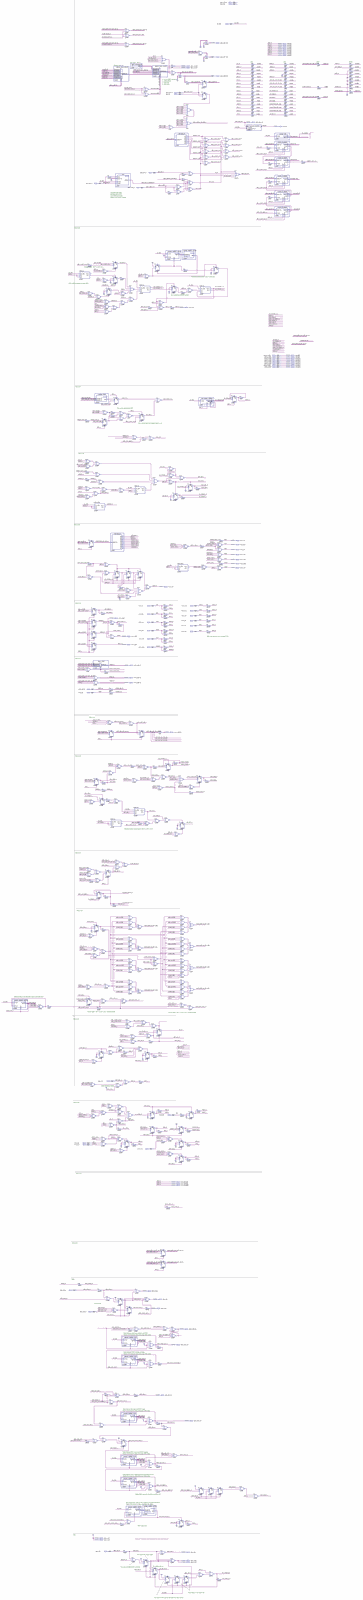
[diagram p0: schematic sheet, whole]
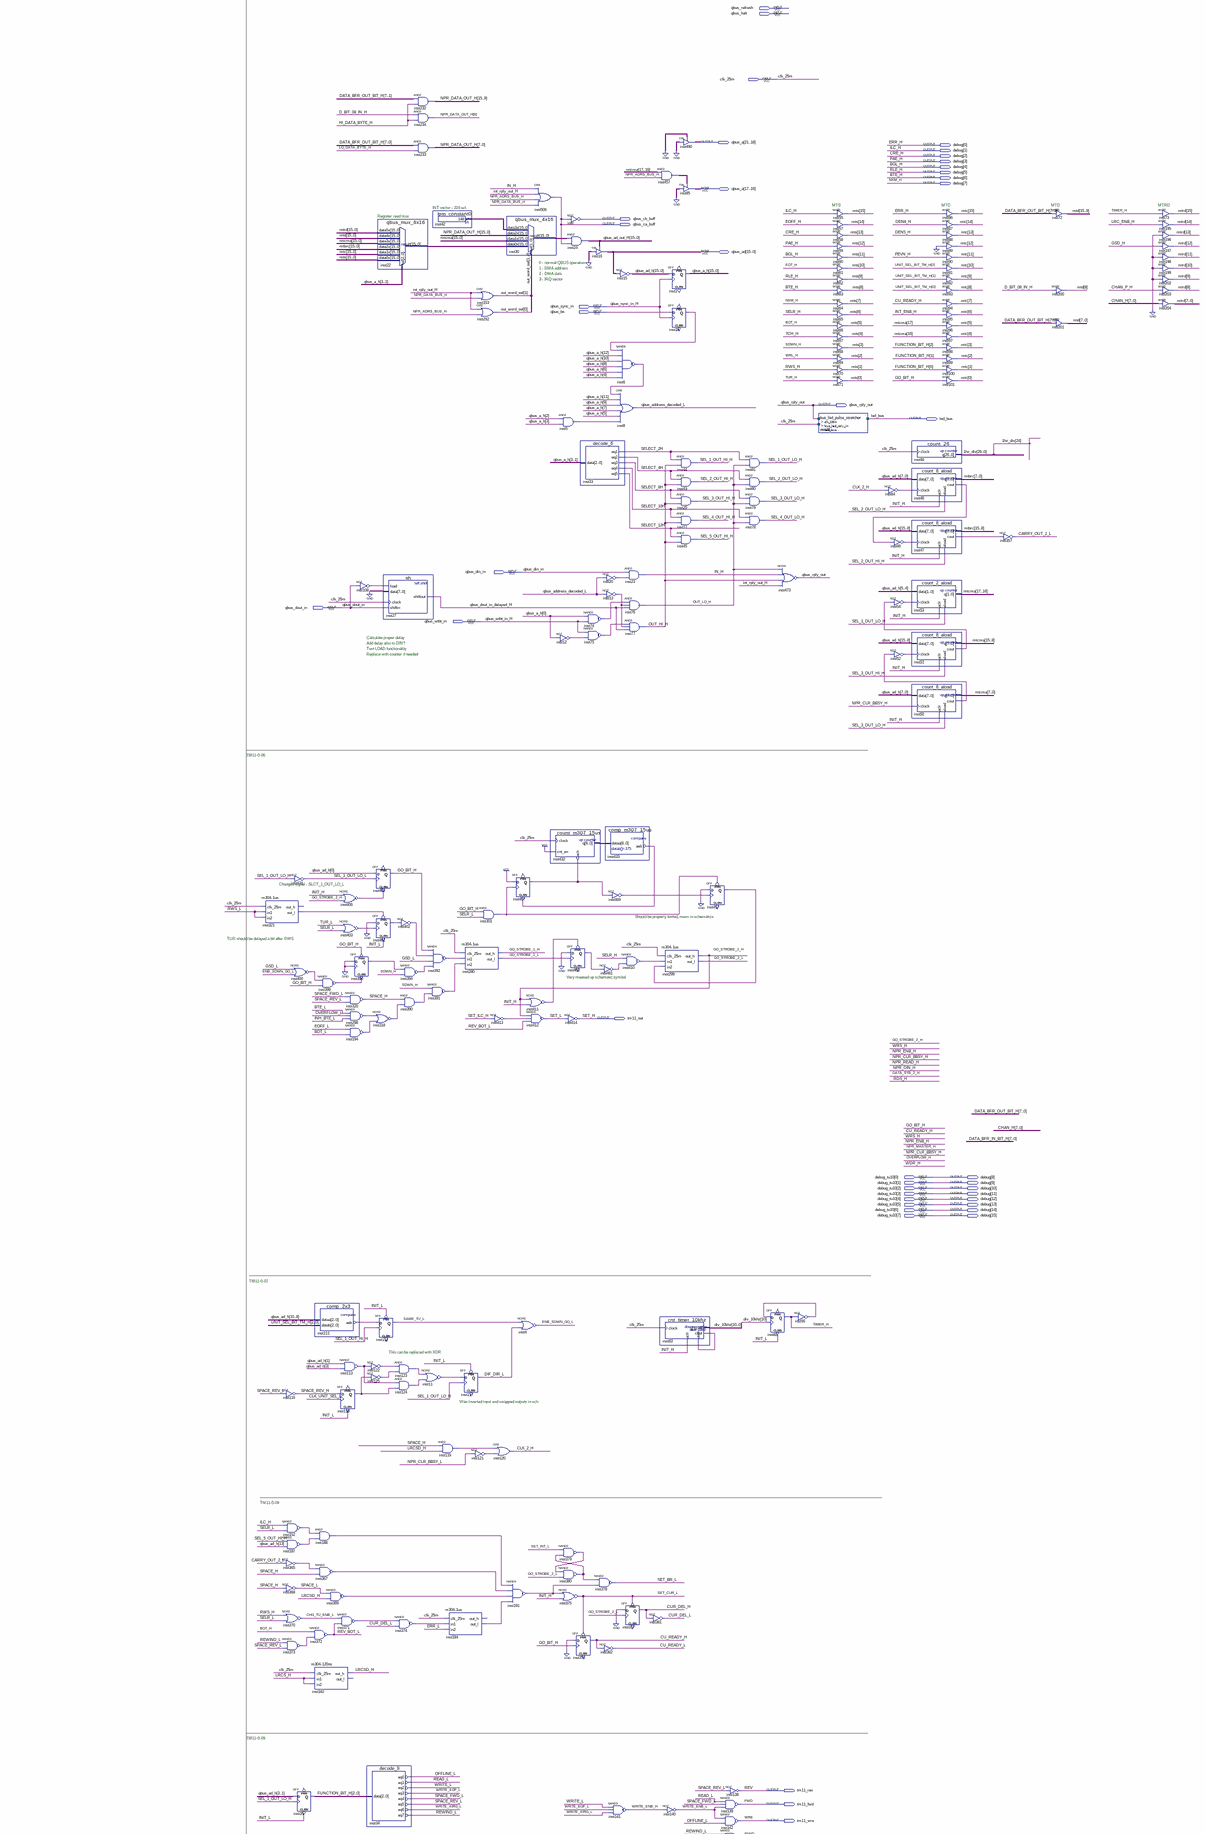
[diagram p1: schematic sheet, upper part]
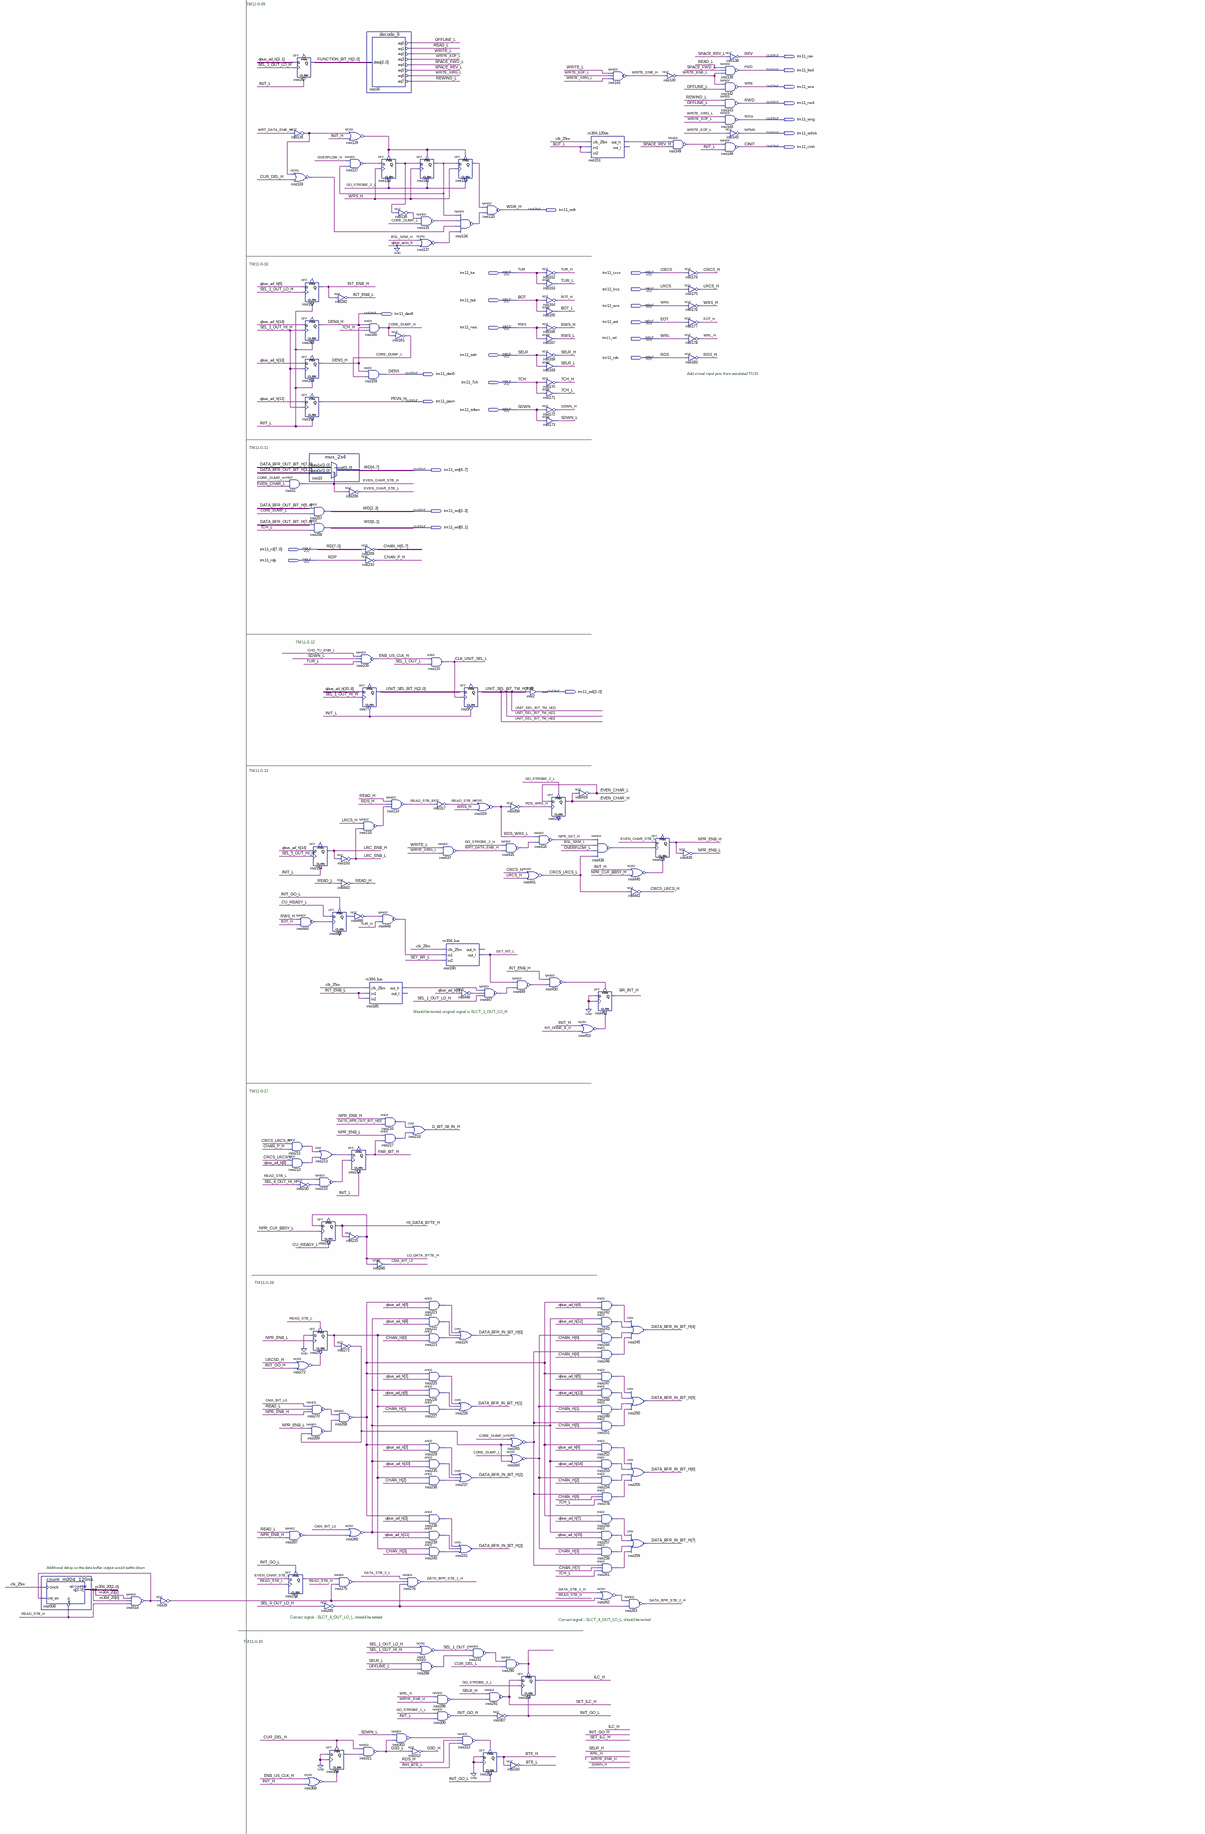
[diagram p2: schematic sheet, middle part]
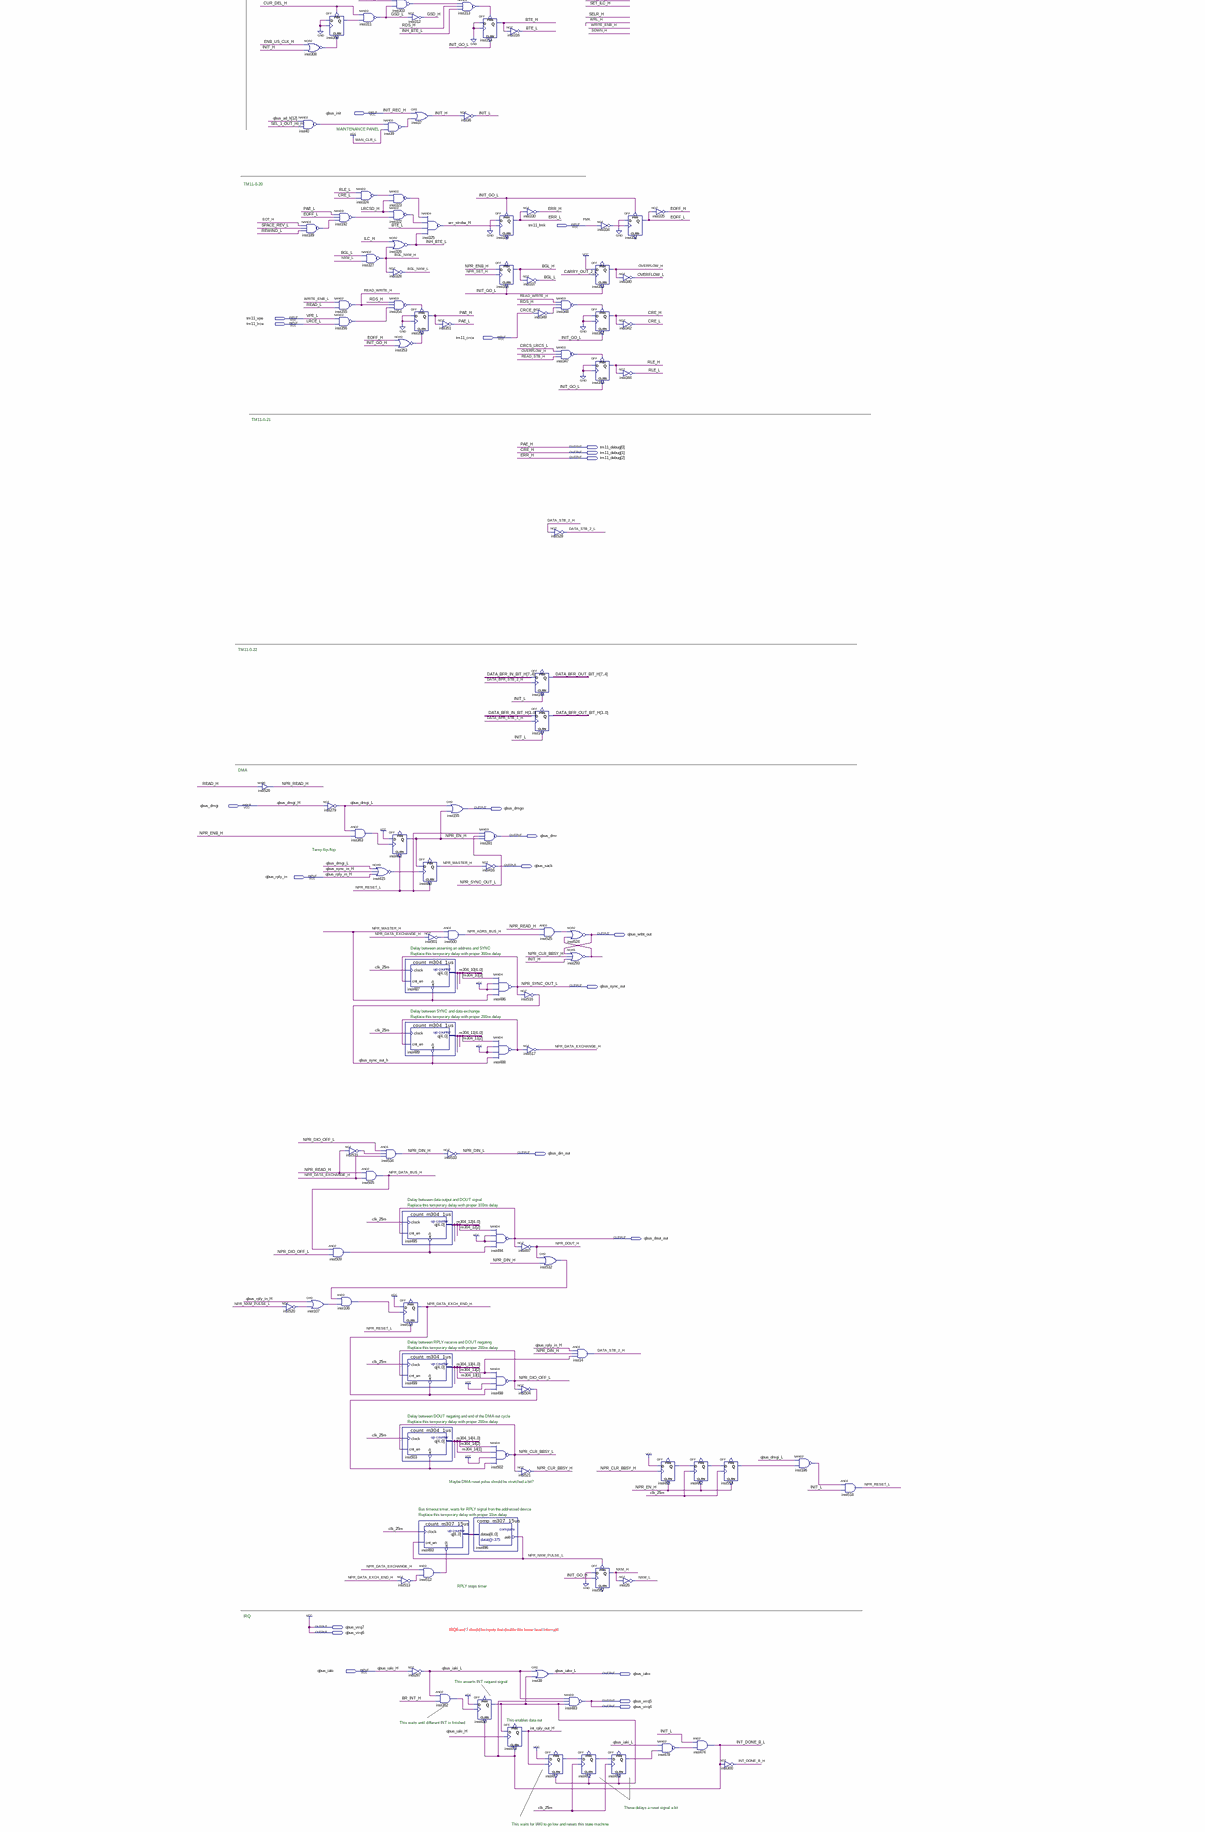
[diagram p3: schematic sheet, lower part]
// Quartus schematic tm11.bdf as structural Verilog: 451 symbols, 92 pins
module tm11 (
  input  qbus_refresh,
  input  qbus_halt,
  input  clk_25m,
  input  qbus_sync_in,
  input  qbus_bs,
  input  qbus_din_in,
  input  qbus_dout_in,
  input  qbus_wtbt_in,
  input  [7:0] debug_tu10,
  input  tm11_tur,
  input  tm11_crcs,
  input  tm11_lrcs,
  input  tm11_bot,
  input  tm11_wrs,
  input  tm11_eot,
  input  tm11_rws,
  input  tm11_wrl,
  input  tm11_selr,
  input  tm11_rds,
  input  tm11_7ch,
  input  tm11_sdwn,
  input  [7:0] tm11_rd,
  input  tm11_rdp,
  input  qbus_init,
  input  tm11_fmk,
  input  tm11_vpe,
  input  tm11_lrce,
  input  tm11_crce,
  input  qbus_dmgi,
  input  qbus_rply_in,
  input  qbus_iaki,
  inout  [21:16] qbus_a,
  inout  [15:0] qbus_ad,
  output [15:0] debug,
  output qbus_cb_buff,
  output qbus_ca_buff,
  output qbus_rply_out,
  output led_bus,
  output tm11_set,
  output tm11_rev,
  output tm11_fwd,
  output tm11_wre,
  output tm11_rwd,
  output tm11_wxg,
  output tm11_wfmk,
  output tm11_cinit,
  output tm11_wdr,
  output tm11_den8,
  output tm11_den5,
  output tm11_pevn,
  output [0:7] tm11_wd,
  output [2:0] tm11_sel,
  output [2:0] tm11_debug,
  output qbus_dmgo,
  output qbus_dmr,
  output qbus_sack,
  output qbus_wtbt_out,
  output qbus_sync_out,
  output qbus_din_out,
  output qbus_dout_out,
  output qbus_virq7,
  output qbus_virq6,
  output qbus_iako,
  output qbus_virq5,
  output qbus_virq4
);

  wire \7CH_H , \7CH_L , BGL_L, BGL_NXM_H, BGL_NXM_L, BOT_H, BOT_L, BR_INT_H, BTE_L, CARRY_OUT_2_L, CHAN_P_H,
       CHG_TU_ENB_L, CLK_2_H, CLK_UNIT_SEL_L, CMA_BIT_L0, CORE_DUMP_H, CORE_DUMP_L, CRCS_H, CRCS_LRCS_H,
       CRCS_LRCS_L, CRE_L, CU_READY_H, CU_READY_L, CUR_DEL_H, CUR_DEL_L, D_BIT_08_IN_H, DATA_BFR_STB_1_H,
       DATA_BFR_STB_2_H, DATA_STB_2_H, DATA_STB_2_L, DEN5_H, DIF_DIR_L, ENB_SDWN_GO_L, ENB_US_CLK_H, EOFF_H,
       EOFF_L, EOT_H, ERR_L, err_strobe_H, EVEN_CHAR_H, EVEN_CHAR_L, EVEN_CHAR_STB_H, EVEN_CHAR_STB_L,
       GO_BIT_H, GO_STROBE_1_H, GO_STROBE_1_L, GO_STROBE_2_H, GO_STROBE_2_L, GSD_H, GSD_L, HI_DATA_BYTE_H,
       IN_H, INH_BTE_L, INIT_GO_H, INIT_GO_L, INIT_H, INIT_L, inst5_out, inst6_out, inst11_out, inst12_out,
       inst13_out, inst18_q, inst20_out, inst29_out, inst34_eq0, inst34_eq1, inst34_eq2, inst34_eq3,
       inst34_eq4, inst34_eq5, inst34_eq6, inst34_eq7, inst39_out, inst40_out, inst46_cout, inst47_cout,
       inst49_out, inst50_cout, inst51_cout, inst52_out, inst54_out, inst56_out, inst74_out, inst75_out,
       inst83_cout, inst84_out, inst106_out, inst107_out, inst108_out, inst111_aeb, inst111_aeb_inverted_out,
       inst113_out, inst115_q, inst118_out, inst119_out, inst121_out, inst122_out, inst123_out, inst124_out,
       inst125_out, inst126_out, inst127_out, inst128_out, inst129_out, inst130_q, inst131_q, inst132_q,
       inst134_out, inst135_out, inst136_out, inst137_out, inst149_out, inst151_out_h, inst152_out,
       inst184_out_l, inst185_out_h, inst186_out, inst187_out, inst188_out, inst189_out, inst191_out,
       inst192_out, inst194_out, inst211_out, inst212_out, inst213_out, inst215_out, inst216_out,
       inst217_out, inst221_out, inst222_out, inst223_out, inst225_out, inst226_out, inst227_out,
       inst229_out, inst230_out, inst231_out, inst235_out, inst236_out, inst238_out, inst239_out,
       inst240_out, inst242_out, inst243_out, inst244_out, inst246_out, inst247_out, inst248_out,
       inst249_out, inst251_out, inst252_out, inst253_out, inst254_out, inst256_out, inst257_out,
       inst258_out, inst261_out, inst262_out, inst264_out, inst265_out, inst266_out, inst267_out,
       inst268_out, inst269_out, inst270_out, inst271_out, inst272_out, inst274_q, inst275_out, inst277_q,
       inst278_out, inst285_out, inst288_out, inst290_out, inst293_out, inst296_out, inst298_out,
       inst301_out, inst303_out, inst308_out, inst309_q, inst313_out, inst318_out, inst321_out_l,
       inst322_out, inst323_out, inst324_out, inst334_out, inst347_out, inst348_out, inst349_out,
       inst353_out, inst354_out, inst356_out, inst362_out, inst363_out, inst365_out, inst367_out,
       inst369_out, inst371_out, inst373_out, inst374_out, inst379_out, inst380_out, inst390_out,
       inst391_out, inst392_out, inst394_out, inst396_q, inst399_out, inst400_out, inst401_q, inst402_out,
       inst403_out, inst406_out, inst408_q, inst410_out, inst411_out, inst413_out, inst415_out, inst417_q,
       inst430_q, inst433_aeb, inst433_aeb_inverted_out, inst435_out, inst436_out, inst440_out, inst444_out,
       inst445_q, inst446_out, inst447_out, inst448_out, inst449_out, inst450_out, inst453_out, inst466_out,
       inst467_q, inst469_out, inst471_q, inst477_q, inst478_out, inst479_q, inst481_out, inst482_q,
       inst485_q, inst488_out, inst496_aeb, inst501_out, inst504_out, inst509_out, inst512_out, inst513_out,
       inst514_out, inst519_q, inst520_out, inst525_out, inst531_out, inst532_out, INT_DONE_B_H,
       INT_DONE_B_L, INT_ENB_H, INT_ENB_L, int_rply_out_H, LO_DATA_BYTE_H, LRC_ENB_H, LRC_ENB_L, LRCS_H,
       LRCSD_H, NPR_ADRS_BUS_H, NPR_CLR_BBSY_H, NPR_CLR_BBSY_L, NPR_DATA_BUS_H, NPR_DATA_EXCH_END_H,
       NPR_DATA_EXCHANGE_H, NPR_DIN_H, NPR_DIO_OFF_L, NPR_DOUT_H, NPR_EN_H, NPR_ENB_H, NPR_ENB_L,
       NPR_MASTER_H, NPR_NXM_PULSE_L, NPR_READ_H, NPR_RESET_L, NPR_SET_H, NXM_L, OFFLINE_L, OUT_HI_H,
       OUT_LO_H, OVERFLOW_H, OVERFLOW_L, PAE_L, PAR_BIT_H, qbus_address_decoded_L, qbus_dmgi_L,
       qbus_dout_in_delayed_H, qbus_iaki_L, qbus_sync_out_h, RDS_H, RDS_WRS_H, RDS_WRS_L, READ_H, READ_L,
       READ_STB_H, READ_STB_L, READ_WRITE_H, REV_BOT_L, REWIND_L, RLE_L, RWS_H, RWS_L, SAME_TU_L, SDWN_H,
       SDWN_L, SEL_1_OUT_HI_H, SEL_1_OUT_L, SEL_1_OUT_LO_H, SEL_1_OUT_LO_L, SEL_2_OUT_HI_H, SEL_2_OUT_LO_H,
       SEL_3_OUT_HI_H, SEL_3_OUT_LO_H, SEL_4_OUT_HI_H, SEL_4_OUT_LO_H, SEL_5_OUT_HI_H, SELECT_2H, SELECT_4H,
       SELECT_6H, SELECT_10H, SELECT_12H, SELR_H, SELR_L, SET_BR_L, SET_CUR_L, SET_ILC_H, SET_INT_L, SET_L,
       SPACE_FWD_L, SPACE_H, SPACE_L, SPACE_REV_H, SPACE_REV_L, TIMER_H, TUR_H, TUR_L, WRITE_ENB_H,
       WRITE_ENB_L, WRITE_EOF_L, WRITE_L, WRITE_XIRG_L, WRL_H, WRS_H, WRT_DATA_ENB_H;
  wire [1:0] inst457_out, out_word_sel;
  wire [2:0] FUNCTION_BIT_H, m304_20, UNIT_SEL_BIT_H, UNIT_SEL_BIT_TM_H;
  wire [4:0] m304_10, m304_11, m304_12, m304_13, m304_14;
  wire [7:0] CHAN_H, DATA_BFR_IN_BIT_H, DATA_BFR_OUT_BIT_H;
  wire [8:0] inst432_q, inst493_q;
  wire [10:0] div_10khz;
  wire [15:0] inst22_result, inst30_result, inst42_result, mtbrc, mtc, mtd, mtrd, mts, NPR_DATA_OUT_H,
       qbus_a_h, qbus_ad_h, qbus_ad_out_H;
  wire [17:0] mtcma;
  wire [26:0] \1hz_div ;

  count_m304_120ns inst508 (.aclr(~READ_STB_H), .clock(clk_25m), .cnt_en(inst514_out), .q(m304_20));
  nand inst514 (inst514_out, m304_20[2], m304_20[0], READ_STB_H);
  not inst29 (inst29_out, inst514_out);
  assign NPR_READ_H = READ_H;  // WIRE inst526
  \m304-1us  inst321 (.clk_25m(clk_25m), .in1(RWS_L), .in2(RWS_L), .out_l(inst321_out_l));  // open: out_h
  not inst431 (SEL_1_OUT_LO_L, SEL_1_OUT_LO_H);
  nor inst400 (inst400_out, GSD_L, ENB_SDWN_GO_L);
  not inst116 (SPACE_REV_H, SPACE_REV_L);
  nand inst152 (inst152_out, debug[1], SELR_L);
  nand inst187 (inst187_out, SEL_5_OUT_HI_H, qbus_ad_h[13]);
  not inst365 (inst365_out, CARRY_OUT_2_L);
  not inst368 (SPACE_L, SPACE_H);
  nor inst370 (CHG_TU_ENB_L, RWS_H, SELR_L);
  nand inst373 (inst373_out, REWIND_L, SPACE_REV_L);
  DFF inst35[2:0] (.CLRN(INIT_L), .CLK(SEL_1_OUT_LO_H), .D(qbus_ad_h[3:1]), .Q(FUNCTION_BIT_H));  // open: PRN
  not inst126 (inst126_out, WRT_DATA_ENB_H);
  nor inst128 (inst128_out, inst126_out, CUR_DEL_H);
  DFF inst157 (.CLRN(INIT_L), .CLK(SEL_1_OUT_LO_H), .D(qbus_ad_h[6]), .Q(INT_ENB_H));  // open: PRN
  DFF inst283 (.CLRN(INIT_L), .CLK(SEL_1_OUT_HI_H), .D(qbus_ad_h[14]), .Q(tm11_den8));  // open: PRN
  DFF inst156 (.CLRN(INIT_L), .CLK(SEL_1_OUT_HI_H), .D(qbus_ad_h[13]), .Q(DEN5_H));  // open: PRN
  DFF inst158 (.CLRN(INIT_L), .CLK(SEL_1_OUT_HI_H), .D(qbus_ad_h[11]), .Q(tm11_pevn));  // open: PRN
  and inst31 (EVEN_CHAR_STB_H, CORE_DUMP_H, EVEN_CHAR_L);
  nand inst444 (inst444_out, RWS_H, BOT_H);
  and inst211 (inst211_out, CRCS_LRCS_H, CHAN_P_H);
  and inst212 (inst212_out, CRCS_LRCS_L, qbus_ad_h[8]);
  not inst230 (inst230_out, SEL_4_OUT_HI_H);
  nor inst272 (inst272_out, LRCSD_H, INIT_GO_H);
  nand inst267 (inst267_out, READ_L, NPR_ENB_H);
  DFF inst274 (.CLK(READ_STB_L), .D(EVEN_CHAR_STB_L), .PRN(INIT_GO_L), .Q(inst274_q));  // open: CLRN
  nand inst40 (inst40_out, qbus_ad_h[12], SEL_1_OUT_HI_H);
  nand inst189 (inst189_out, EOT_H, SPACE_REV_L, REWIND_L);
  not inst520 (inst520_out, NPR_NXM_PULSE_L);
  nand inst399 (inst399_out, inst400_out, GO_BIT_H);
  comp_2x3 inst111 (.dataa(qbus_ad_h[10:8]), .datab(UNIT_SEL_BIT_TM_H), .aeb(inst111_aeb));
  not inst111_aeb_inverted (inst111_aeb_inverted_out, inst111_aeb);
  and inst188 (inst188_out, inst152_out, inst187_out);
  nand inst367 (inst367_out, inst365_out, SPACE_H);
  nand inst372 (REV_BOT_L, BOT_H, inst373_out);
  \m304-120ns  inst182 (.clk_25m(clk_25m), .in1(LRCS_H), .in2(LRCS_H), .out_h(LRCSD_H));  // open: out_l
  mux_2x4 inst10 (
    .data1x(DATA_BFR_OUT_BIT_H[7:4]), .data0x(DATA_BFR_OUT_BIT_H[3:0]), .sel(EVEN_CHAR_STB_H),
    .result(tm11_wd[4:7]));
  assign tm11_wd[2:3] = DATA_BFR_OUT_BIT_H[5:4] & {2{CORE_DUMP_L}};  // AND2 inst207, 2 bits wide
  assign tm11_wd[0:1] = DATA_BFR_OUT_BIT_H[7:6] & {2{\7CH_L }};  // AND2 inst208, 2 bits wide
  DFF inst154 (.CLRN(INIT_L), .CLK(SEL_5_OUT_HI_H), .D(qbus_ad_h[14]), .Q(LRC_ENB_H));  // open: PRN
  or inst213 (inst213_out, inst211_out, inst212_out);
  nand inst215 (inst215_out, READ_STB_L, inst230_out);
  DFF inst219 (.CLRN(CU_READY_L), .CLK(NPR_CLR_BBSY_L), .D(LO_DATA_BYTE_H), .Q(HI_DATA_BYTE_H));  // open: PRN
  DFF inst277 (.CLRN(inst272_out), .CLK(NPR_ENB_L), .D(1'b0), .PRN(READ_STB_L), .Q(inst277_q));
  nand inst270 (inst270_out, CMA_BIT_L0, READ_L, NPR_ENB_H);
  nand inst269 (inst269_out, NPR_ENB_L, inst271_out);
  not inst285 (inst285_out, SEL_4_OUT_LO_H);
  nor inst308 (inst308_out, ENB_US_CLK_H, INIT_H);
  not inst279 (qbus_dmgi_L, qbus_dmgi);
  or inst107 (inst107_out, qbus_rply_in, inst520_out);
  nor inst406 (inst406_out, INIT_H, GO_STROBE_2_H);
  nor inst403 (inst403_out, TUR_L, SELR_L);
  nand inst320 (SPACE_H, SPACE_FWD_L, SPACE_REV_L);
  nand inst298 (inst298_out, BTE_L, OVERFLOW_L, INH_BTE_L);
  nand inst194 (inst194_out, EOFF_L, BOT_L);
  nand inst113 (inst113_out, qbus_ad_h[1], qbus_ad_h[3]);
  DFF inst115 (.CLRN(INIT_L), .CLK(CLK_UNIT_SEL_L), .D(SPACE_REV_H), .Q(inst115_q));  // open: PRN
  nand inst369 (inst369_out, SPACE_L, LRCSD_H);
  nand inst371 (inst371_out, CHG_TU_ENB_L, REV_BOT_L);
  nor inst129 (inst129_out, inst126_out, INIT_H);
  nand inst127 (inst127_out, OVERFLOW_H, inst131_q);
  not inst282 (INT_ENB_L, INT_ENB_H);
  not inst206 (EVEN_CHAR_STB_L, EVEN_CHAR_STB_H);
  not inst193 (LRC_ENB_L, LRC_ENB_H);
  not inst443 (READ_H, READ_L);
  DFF inst445 (.CLK(inst444_out), .D(CU_READY_L), .PRN(INIT_GO_L), .Q(inst445_q));  // open: CLRN
  not inst220 (LO_DATA_BYTE_H, HI_DATA_BYTE_H);
  not inst271 (inst271_out, inst277_q);
  nand inst268 (inst268_out, inst270_out, inst269_out);
  nor inst266 (inst266_out, CMA_BIT_L0, inst267_out);
  nand inst275 (inst275_out, inst274_q, inst29_out);
  DFF inst309 (.CLRN(inst308_out), .CLK(1'b0), .D(1'b0), .PRN(CUR_DEL_H), .Q(inst309_q));
  nand inst192 (inst192_out, PAE_L, EOFF_L, inst189_out);
  nand inst355 (READ_WRITE_H, WRITE_ENB_L, READ_L);
  nand inst356 (inst356_out, tm11_vpe, tm11_lrce);
  not inst531 (inst531_out, NPR_READ_H);
  and inst509 (inst509_out, NPR_DATA_BUS_H, NPR_DIO_OFF_L);
  and inst106 (inst106_out, inst532_out, inst107_out);
  not inst108 (inst108_out, qbus_dout_in);
  DFF inst396 (.CLRN(inst399_out), .CLK(1'b0), .D(1'b0), .PRN(GO_BIT_H), .Q(inst396_q));
  not inst122 (inst122_out, inst113_out);
  not inst125 (inst125_out, inst115_q);
  decode_8 inst34 (
    .data(FUNCTION_BIT_H), .eq0(inst34_eq0), .eq1(inst34_eq1), .eq2(inst34_eq2), .eq3(inst34_eq3),
    .eq4(inst34_eq4), .eq5(inst34_eq5), .eq6(inst34_eq6), .eq7(inst34_eq7));
  not inst34_eq0_inverted (OFFLINE_L, inst34_eq0);
  not inst34_eq1_inverted (READ_L, inst34_eq1);
  not inst34_eq2_inverted (WRITE_L, inst34_eq2);
  not inst34_eq3_inverted (WRITE_EOF_L, inst34_eq3);
  not inst34_eq4_inverted (SPACE_FWD_L, inst34_eq4);
  not inst34_eq5_inverted (SPACE_REV_L, inst34_eq5);
  not inst34_eq6_inverted (WRITE_XIRG_L, inst34_eq6);
  not inst34_eq7_inverted (REWIND_L, inst34_eq7);
  and inst160 (CORE_DUMP_H, tm11_den8, DEN5_H, \7CH_H );
  and inst159 (tm11_den5, DEN5_H, CORE_DUMP_L);
  assign {CHAN_H[0], CHAN_H[1], CHAN_H[2], CHAN_H[3], CHAN_H[4], CHAN_H[5], CHAN_H[6], CHAN_H[7]} = ~tm11_rd;  // NOT inst209, 8 bits wide
  not inst210 (CHAN_P_H, tm11_rdp);
  nand inst109 (ENB_US_CLK_H, CHG_TU_ENB_L, SDWN_L, TUR_L);
  DFF inst7[2:0] (.CLRN(INIT_L), .CLK(SEL_1_OUT_HI_H), .D(qbus_ad_h[10:8]), .Q(UNIT_SEL_BIT_H));  // open: PRN
  nand inst118 (inst118_out, LRCS_H, LRC_ENB_L);
  not inst466 (inst466_out, inst445_q);
  \m304-1us  inst185 (.clk_25m(clk_25m), .in1(INT_ENB_L), .in2(INT_ENB_L), .out_h(inst185_out_h));  // open: out_l
  DFF inst214 (.CLRN(INIT_L), .CLK(inst215_out), .D(inst213_out), .Q(PAR_BIT_H));  // open: PRN
  nand inst311 (GSD_L, CUR_DEL_H, inst309_q);
  nand inst324 (inst324_out, RLE_L, CRE_L);
  nand inst327 (BGL_NXM_H, BGL_L, NXM_L);
  and inst363 (inst363_out, qbus_dmgi_L, NPR_ENB_H);
  and inst505 (NPR_DATA_BUS_H, NPR_READ_H, NPR_DATA_EXCHANGE_H);
  qbus_mux_8x16 inst22 (
    .data5x(mtrd), .data4x(mtd), .data3x(mtcma[15:0]), .data2x(mtbrc), .data1x(mtc), .data0x(mts),
    .sel(qbus_a_h[3:1]), .result(inst22_result));
  sh inst27 (
    .load(inst108_out), .data({8{1'b0}}), .clock(clk_25m), .shiftin(qbus_dout_in),
    .shiftout(qbus_dout_in_delayed_H));
  DFF inst405 (.CLRN(inst406_out), .CLK(SEL_1_OUT_LO_L), .D(qbus_ad_h[0]), .Q(GO_BIT_H));  // open: PRN
  DFF inst401 (.CLRN(INIT_L), .CLK(inst403_out), .D(1'b0), .PRN(inst321_out_l), .Q(inst401_q));
  nor inst318 (inst318_out, inst298_out, inst194_out);
  DFF inst112 (.CLK(SEL_1_OUT_HI_H), .D(inst111_aeb_inverted_out), .PRN(INIT_L), .Q(SAME_TU_L));  // open: CLRN
  DFF inst130 (.CLRN(GO_STROBE_2_L), .CLK(WRS_H), .D(inst127_out), .PRN(inst129_out), .Q(inst130_q));
  nand inst114 (READ_STB_L, READ_H, RDS_H, inst118_out);
  nand inst446 (inst446_out, inst466_out, TUR_H);
  and inst216 (inst216_out, NPR_ENB_H, DATA_BFR_OUT_BIT_H[0]);
  and inst217 (inst217_out, NPR_ENB_L, PAR_BIT_H);
  assign CMA_BIT_L0 = LO_DATA_BYTE_H;  // WIRE inst286
  nand inst39 (inst39_out, inst40_out, 1'b1);
  nand inst323 (inst323_out, inst324_out, LRCSD_H);
  nand inst322 (inst322_out, LRCSD_H, inst192_out);
  nor inst326 (INH_BTE_L, debug[1], BGL_NXM_H);
  not inst328 (BGL_NXM_L, BGL_NXM_H);
  nand inst354 (inst354_out, RDS_H, READ_WRITE_H, inst356_out);
  DFF inst468 (.CLRN(NPR_RESET_L), .CLK(inst363_out), .D(1'b1), .Q(NPR_EN_H));  // open: PRN
  nor inst415 (inst415_out, qbus_dmgi_L, qbus_sync_in, qbus_rply_in);
  and inst534 (NPR_DIN_H, NPR_DIO_OFF_L, inst531_out, NPR_DATA_EXCHANGE_H);
  not inst402 (inst402_out, inst401_q);
  nand inst394 (inst394_out, inst396_q, SDWN_H);
  and inst390 (inst390_out, SPACE_H, inst318_out);
  and inst123 (inst123_out, inst122_out, inst125_out);
  and inst124 (inst124_out, inst113_out, inst115_q);
  nand inst374 (inst374_out, inst371_out, CUR_DEL_L);
  not inst136 (inst136_out, inst130_q);
  not inst161 (CORE_DUMP_L, CORE_DUMP_H);
  or inst218 (D_BIT_08_IN_H, inst216_out, inst217_out);
  nand inst276 (DATA_BFR_STB_1_H, DATA_STB_2_L, inst275_out, inst285_out);
  nand inst303 (inst303_out, SDWN_L, GSD_L);
  not inst312 (GSD_H, GSD_L);
  or inst37 (INIT_H, qbus_init, inst39_out);
  DFF inst350 (.CLRN(inst353_out), .CLK(1'b0), .D(1'b0), .PRN(inst354_out), .Q(debug[3]));
  nor inst353 (inst353_out, EOFF_H, INIT_GO_H);
  count_m304_1us inst487 (.aclr(~NPR_MASTER_H), .clock(clk_25m), .cnt_en(qbus_sync_out), .q(m304_10));
  count_m304_1us inst489 (.aclr(~qbus_sync_out_h), .clock(clk_25m), .cnt_en(inst488_out), .q(m304_11));
  count_m304_1us inst495 (.aclr(~inst509_out), .clock(clk_25m), .cnt_en(qbus_dout_out), .q(m304_12));
  DFF inst510 (.CLRN(NPR_RESET_L), .CLK(inst106_out), .D(1'b1), .Q(NPR_DATA_EXCH_END_H));  // open: PRN
  count_m304_1us inst499 (.aclr(~NPR_DATA_EXCH_END_H), .clock(clk_25m), .cnt_en(NPR_DIO_OFF_L), .q(m304_13));
  count_m304_1us inst503 (.aclr(~inst504_out), .clock(clk_25m), .cnt_en(NPR_CLR_BBSY_L), .q(m304_14));
  not inst513 (inst513_out, NPR_DATA_EXCH_END_H);
  not inst287 (qbus_iaki_L, qbus_iaki);
  assign NPR_DATA_OUT_H[15:9] = DATA_BFR_OUT_BIT_H[7:1] & {7{HI_DATA_BYTE_H}};  // AND2 inst232, 7 bits wide
  and inst234 (NPR_DATA_OUT_H[8], D_BIT_08_IN_H, HI_DATA_BYTE_H);
  assign NPR_DATA_OUT_H[7:0] = DATA_BFR_OUT_BIT_H & {8{LO_DATA_BYTE_H}};  // AND2 inst233, 8 bits wide
  lpm_constant0 inst42 (.result(inst42_result));
  nand inst392 (inst392_out, GO_BIT_H, inst402_out, GSD_L, inst394_out);
  nand inst391 (inst391_out, SDWN_H, inst390_out);
  nor inst11 (inst11_out, inst123_out, inst124_out);
  DFF inst131 (.CLRN(GO_STROBE_2_L), .CLK(WRS_H), .D(inst130_q), .PRN(inst129_out), .Q(inst131_q));
  nand inst135 (inst135_out, inst136_out, CORE_DUMP_L);
  nor inst137 (inst137_out, BGL_NXM_H, 1'b0);
  and inst110 (CLK_UNIT_SEL_L, ENB_US_CLK_H, SEL_1_OUT_L);
  not inst317 (READ_STB_H, READ_STB_L);
  and inst221 (inst221_out, inst268_out, qbus_ad_h[0]);
  and inst222 (inst222_out, inst266_out, qbus_ad_h[8]);
  and inst223 (inst223_out, inst277_q, CHAN_H[0]);
  and inst225 (inst225_out, inst268_out, qbus_ad_h[1]);
  and inst226 (inst226_out, inst266_out, qbus_ad_h[9]);
  and inst227 (inst227_out, inst277_q, CHAN_H[1]);
  and inst229 (inst229_out, inst268_out, qbus_ad_h[2]);
  and inst235 (inst235_out, inst266_out, qbus_ad_h[10]);
  and inst236 (inst236_out, inst277_q, CHAN_H[2]);
  and inst238 (inst238_out, inst268_out, qbus_ad_h[3]);
  and inst239 (inst239_out, inst266_out, qbus_ad_h[11]);
  and inst240 (inst240_out, inst277_q, CHAN_H[3]);
  nor inst3 (SEL_1_OUT_L, SEL_1_OUT_LO_H, SEL_1_OUT_HI_H);
  nand inst288 (inst288_out, SELR_L, OFFLINE_L);
  nand inst296 (inst296_out, WRL_H, WRITE_ENB_H);
  nand inst306 (INIT_GO_H, GO_STROBE_1_L, INIT_L);
  nand inst325 (err_strobe_H, inst323_out, inst322_out, BTE_L, INH_BTE_L);
  DFF inst480 (.CLRN(NPR_RESET_L), .CLK(inst415_out), .D(NPR_EN_H), .Q(NPR_MASTER_H));  // open: PRN
  not inst501 (inst501_out, NPR_DATA_EXCHANGE_H);
  count_m307_15us inst493 (.aclr(~inst512_out), .clock(clk_25m), .cnt_en(NPR_NXM_PULSE_L), .q(inst493_q));
  and inst512 (inst512_out, NPR_DATA_EXCHANGE_H, inst513_out);
  and inst119 (inst119_out, SPACE_H, LRCSD_H);
  \m304-1us  inst184 (.clk_25m(clk_25m), .in1(inst374_out), .in2(ERR_L), .out_l(inst184_out_l));  // open: out_h
  DFF inst132 (.CLRN(GO_STROBE_2_L), .CLK(WRS_H), .D(inst131_q), .PRN(inst129_out), .Q(inst132_q));
  nand inst134 (inst134_out, inst131_q, inst135_out, inst128_out, inst137_out);
  nand inst437 (WRT_DATA_ENB_H, WRITE_L, WRITE_XIRG_L);
  \m304-1us  inst190 (.clk_25m(clk_25m), .in1(inst446_out), .in2(SET_BR_L), .out_l(SET_INT_L));  // open: out_h
  or inst224 (DATA_BFR_IN_BIT_H[0], inst221_out, inst222_out, inst223_out);
  or inst228 (DATA_BFR_IN_BIT_H[1], inst225_out, inst226_out, inst227_out);
  or inst237 (DATA_BFR_IN_BIT_H[2], inst229_out, inst235_out, inst236_out);
  or inst241 (DATA_BFR_IN_BIT_H[3], inst238_out, inst239_out, inst240_out);
  not inst351 (PAE_L, debug[3]);
  or inst155 (qbus_dmgo, qbus_dmgi_L, NPR_EN_H);
  and inst500 (NPR_ADRS_BUS_H, NPR_MASTER_H, inst501_out);
  not inst533 (qbus_din_out, NPR_DIN_H);
  and inst362 (inst362_out, qbus_iaki_L, BR_INT_H);
  or inst153 (out_word_sel[1], int_rply_out_H, NPR_DATA_BUS_H);
  or inst292 (out_word_sel[0], int_rply_out_H, NPR_ADRS_BUS_H);
  \m304-1us  inst280 (
    .clk_25m(clk_25m), .in1(inst392_out), .in2(inst391_out), .out_h(GO_STROBE_1_H), .out_l(GO_STROBE_1_L));
  DFF inst117 (.CLK(SEL_1_OUT_LO_H), .D(inst11_out), .PRN(INIT_L), .Q(DIF_DIR_L));  // open: CLRN
  not inst121 (inst121_out, NPR_CLR_BBSY_L);
  DFF inst9[2:0] (.CLRN(INIT_L), .CLK(CLK_UNIT_SEL_L), .D(UNIT_SEL_BIT_H), .Q(UNIT_SEL_BIT_TM_H));  // open: PRN
  nor inst319 (RDS_WRS_L, READ_STB_H, WRS_H);
  not inst448 (inst448_out, qbus_ad_h[0]);
  nand inst231 (inst231_out, SEL_1_OUT_L, inst288_out);
  nand inst313 (inst313_out, inst303_out, RDS_H, INH_BTE_L);
  not inst36 (INIT_L, INIT_H);
  comp_m307_15us inst496 (.dataa(inst493_q), .aeb(inst496_aeb));
  not inst496_aeb_inverted (NPR_NXM_PULSE_L, inst496_aeb);
  DFF inst430 (.CLRN(INT_DONE_B_L), .CLK(inst362_out), .D(1'b1), .Q(inst430_q));  // open: PRN
  and inst301 (inst301_out, GO_BIT_H, SELR_L);
  not inst413 (inst413_out, SET_ILC_H);
  or inst120 (CLK_2_H, inst119_out, inst121_out);
  nand inst133 (tm11_wdr, inst132_q, inst134_out);
  nand inst447 (inst447_out, inst185_out_h, inst448_out, SEL_1_OUT_LO_H);
  nand inst291 (SET_ILC_H, SELR_H, inst296_out);
  not inst307 (INIT_GO_L, INIT_GO_H);
  DFF inst314 (.CLRN(INIT_GO_L), .CLK(1'b0), .D(1'b0), .PRN(inst313_out), .Q(debug[6]));
  DFF inst329 (.CLK(err_strobe_H), .D(1'b0), .PRN(INIT_GO_L), .Q(ERR_L));  // open: CLRN
  DFF inst336 (.CLRN(INIT_GO_L), .CLK(NPR_SET_H), .D(NPR_ENB_H), .Q(debug[4]));  // open: PRN
  nand inst281 (qbus_dmr, NPR_RESET_L, qbus_sync_out, NPR_EN_H);
  not inst416 (qbus_sack, NPR_MASTER_H);
  nand inst486 (qbus_sync_out, m304_10[3], 1'b1, 1'b1, NPR_MASTER_H);
  nand inst488 (inst488_out, m304_11[2], 1'b1, 1'b1, qbus_sync_out_h);
  nand inst494 (qbus_dout_out, m304_12[2], 1'b1, 1'b1, inst509_out);
  nand inst498 (NPR_DIO_OFF_L, m304_13[2], m304_13[1], 1'b1, NPR_DATA_EXCH_END_H);
  nand inst502 (NPR_CLR_BBSY_L, m304_14[2], m304_14[1], 1'b1, inst504_out);
  qbus_mux_4x16 inst30 (
    .data3x(inst42_result), .data2x(NPR_DATA_OUT_H), .data1x(mtcma[15:0]), .data0x(inst22_result),
    .sel(out_word_sel), .result(inst30_result));
  DFF inst467 (.CLRN(inst433_aeb_inverted_out), .CLK(inst301_out), .D(1'b1), .Q(inst467_q));  // open: PRN
  nor inst4 (ENB_SDWN_GO_L, SAME_TU_L, DIF_DIR_L);
  nand inst191 (inst191_out, inst188_out, inst367_out, inst369_out, inst184_out_l);
  not inst358 (RDS_WRS_H, RDS_WRS_L);
  nand inst435 (inst435_out, GO_STROBE_2_H, WRT_DATA_ENB_H);
  nand inst449 (inst449_out, SET_INT_L, inst447_out);
  nor inst265 (inst265_out, CORE_DUMP_H, inst271_out);
  nor inst264 (inst264_out, CORE_DUMP_L, inst271_out);
  nand inst290 (inst290_out, inst231_out, CUR_DEL_L);
  DFF inst304 (.CLRN(INIT_GO_L), .CLK(GO_STROBE_2_L), .D(SET_ILC_H), .PRN(inst290_out), .Q(debug[1]));
  not inst316 (BTE_L, debug[6]);
  not inst516 (qbus_sync_out_h, qbus_sync_out);
  not inst497 (NPR_DOUT_H, qbus_dout_out);
  not inst504 (inst504_out, NPR_DIO_OFF_L);
  not inst521 (NPR_CLR_BBSY_H, NPR_CLR_BBSY_L);
  DFF inst476 (.CLRN(INT_DONE_B_L), .CLK(qbus_iaki), .D(inst430_q), .Q(int_rply_out_H));  // open: PRN
  or inst506 (qbus_ca_buff, IN_H, int_rply_out_H, NPR_ADRS_BUS_H, NPR_DATA_BUS_H);
  nor inst411 (inst411_out, GO_STROBE_2_H, INIT_H);
  nand inst412 (SET_L, GO_STROBE_2_H, inst413_out, REV_BOT_L);
  not inst162 (TUR_H, tm11_tur);
  assign TUR_L = tm11_tur;  // WIRE inst163
  not inst164 (BOT_H, tm11_bot);
  assign BOT_L = tm11_bot;  // WIRE inst165
  not inst166 (RWS_H, tm11_rws);
  assign RWS_L = tm11_rws;  // WIRE inst167
  not inst168 (SELR_H, tm11_selr);
  assign SELR_L = tm11_selr;  // WIRE inst169
  not inst170 (\7CH_H , tm11_7ch);
  assign \7CH_L  = tm11_7ch;  // WIRE inst171
  not inst172 (SDWN_H, tm11_sdwn);
  assign SDWN_L = tm11_sdwn;  // WIRE inst173
  assign tm11_sel = UNIT_SEL_BIT_TM_H;  // WIRE inst2
  nand inst434 (NPR_SET_H, RDS_WRS_L, inst435_out);
  nor inst441 (CRCS_LRCS_L, CRCS_H, LRCS_H);
  not inst330 (debug[0], ERR_L);
  not inst337 (BGL_L, debug[4]);
  not inst349 (inst349_out, tm11_crce);
  DFF inst146[3:0] (
    .CLRN(INIT_L), .CLK(DATA_BFR_STB_2_H), .D(DATA_BFR_IN_BIT_H[7:4]), .Q(DATA_BFR_OUT_BIT_H[7:4]));  // open: PRN
  DFF inst147[3:0] (
    .CLRN(INIT_L), .CLK(DATA_BFR_STB_1_H), .D(DATA_BFR_IN_BIT_H[3:0]), .Q(DATA_BFR_OUT_BIT_H[3:0]));  // open: PRN
  and inst525 (inst525_out, NPR_READ_H, NPR_ADRS_BUS_H);
  not inst517 (NPR_DATA_EXCHANGE_H, inst488_out);
  or inst532 (inst532_out, NPR_DOUT_H, NPR_DIN_H);
  or inst38 (qbus_iako, qbus_iaki_L, inst430_q);
  and inst5 (inst5_out, qbus_a_h[2], qbus_a_h[3]);
  not inst12 (inst12_out, qbus_a_h[0]);
  count_m307_15us inst432 (.aclr(~inst467_q), .clock(clk_25m), .cnt_en(1'b1), .q(inst432_q));
  not inst414 (tm11_set, SET_L);
  nand inst379 (inst379_out, SET_INT_L, inst380_out);
  nand inst380 (inst380_out, inst379_out, GO_STROBE_2_L);
  nor inst375 (SET_CUR_L, inst191_out, INIT_H);
  DFF inst359 (.CLK(RDS_WRS_H), .D(EVEN_CHAR_L), .PRN(GO_STROBE_2_L), .Q(EVEN_CHAR_H));  // open: CLRN
  nand inst450 (inst450_out, INT_ENB_H, inst449_out);
  nand inst348 (inst348_out, READ_WRITE_H, RDS_H, inst349_out);
  nand inst347 (inst347_out, CRCS_LRCS_L, OVERFLOW_H, READ_STB_H);
  not inst528 (DATA_STB_2_L, DATA_STB_2_H);
  nand inst483 (qbus_virq4, qbus_iaki_L, INT_DONE_B_L, inst430_q);
  DFF inst477 (.CLRN(inst430_q), .CLK(int_rply_out_H), .D(1'b1), .Q(inst477_q));  // open: PRN
  not inst (qbus_cb_buff, qbus_ca_buff);
  assign qbus_ad_out_H = inst30_result & {16{qbus_ca_buff}};  // AND2 inst24, 16 bits wide
  decode_6 inst33 (
    .data(qbus_a_h[3:1]), .eq1(SELECT_2H), .eq2(SELECT_4H), .eq3(SELECT_6H), .eq4(SELECT_10H),
    .eq5(SELECT_12H));
  nand inst74 (inst74_out, qbus_a_h[0], qbus_wtbt_in);
  nand inst75 (inst75_out, qbus_wtbt_in, inst12_out);
  DFF inst408 (.CLK(GO_STROBE_1_L), .D(1'b0), .PRN(inst411_out), .Q(inst408_q));  // open: CLRN
  DFF inst376 (.CLK(GO_BIT_H), .D(1'b0), .PRN(SET_CUR_L), .Q(CU_READY_H));  // open: CLRN
  \m304-120ns  inst151 (.clk_25m(clk_25m), .in1(BOT_L), .in2(BOT_L), .out_h(inst151_out_h));  // open: out_l
  not inst419 (EVEN_CHAR_L, EVEN_CHAR_H);
  nor inst453 (inst453_out, INIT_H, INT_DONE_B_H);
  nor inst524 (qbus_wtbt_out, inst525_out, inst293_out);
  nor inst293 (inst293_out, qbus_wtbt_out, NPR_CLR_BBSY_H, INIT_H);
  and inst14 (DATA_STB_2_H, qbus_rply_in, NPR_DIN_H, m304_13[2]);
  DFF inst471 (.CLRN(inst430_q), .CLK(clk_25m), .D(inst477_q), .Q(inst471_q));  // open: PRN
  TRI inst16[15:0] (.IN({16{1'b0}}), .OE(qbus_ad_out_H), .OUT(qbus_ad));
  not inst20 (inst20_out, qbus_address_decoded_L);
  not inst13 (inst13_out, qbus_address_decoded_L);
  comp_m307_15us inst433 (.dataa(inst432_q), .aeb(inst433_aeb));
  not inst433_aeb_inverted (inst433_aeb_inverted_out, inst433_aeb);
  not inst469 (inst469_out, inst467_q);
  not inst481 (inst481_out, inst408_q);
  nand inst378 (SET_BR_L, inst380_out, inst191_out);
  not inst382 (CU_READY_L, CU_READY_H);
  nand inst141 (WRITE_ENB_H, WRITE_L, WRITE_EOF_L, WRITE_XIRG_L);
  nand inst436 (inst436_out, NPR_SET_H, BGL_NXM_L, OVERFLOW_L, CRCS_LRCS_L);
  DFF inst451 (.CLRN(inst453_out), .CLK(1'b0), .D(1'b0), .PRN(inst450_out), .Q(BR_INT_H));
  and inst242 (inst242_out, inst268_out, qbus_ad_h[4]);
  and inst243 (inst243_out, inst266_out, qbus_ad_h[12]);
  and inst244 (inst244_out, inst264_out, CHAN_H[0]);
  and inst246 (inst246_out, inst265_out, CHAN_H[4]);
  and inst247 (inst247_out, inst268_out, qbus_ad_h[5]);
  and inst248 (inst248_out, inst266_out, qbus_ad_h[13]);
  and inst249 (inst249_out, inst264_out, CHAN_H[1]);
  and inst251 (inst251_out, inst265_out, CHAN_H[5]);
  and inst252 (inst252_out, inst268_out, qbus_ad_h[6]);
  and inst253 (inst253_out, inst266_out, qbus_ad_h[14]);
  and inst254 (inst254_out, inst264_out, CHAN_H[2]);
  and inst278 (inst278_out, inst265_out, CHAN_H[6], \7CH_L );
  and inst256 (inst256_out, inst268_out, qbus_ad_h[7]);
  and inst257 (inst257_out, inst266_out, qbus_ad_h[15]);
  and inst258 (inst258_out, inst264_out, CHAN_H[3]);
  and inst261 (inst261_out, inst265_out, CHAN_H[7], \7CH_L );
  nor inst262 (inst262_out, DATA_STB_2_H, inst29_out);
  not inst334 (inst334_out, tm11_fmk);
  DFF inst338 (.CLRN(INIT_GO_L), .CLK(CARRY_OUT_2_L), .D(1'b1), .Q(OVERFLOW_H));  // open: PRN
  DFF inst341 (.CLRN(INIT_GO_L), .CLK(1'b0), .D(1'b0), .PRN(inst348_out), .Q(debug[2]));
  DFF inst343 (.CLRN(INIT_GO_L), .CLK(1'b0), .D(1'b0), .PRN(inst347_out), .Q(debug[5]));
  DFF inst507 (.CLK(INIT_GO_H), .D(1'b0), .PRN(NPR_NXM_PULSE_L), .Q(debug[7]));  // open: CLRN
  DFF inst479 (.CLRN(inst430_q), .CLK(clk_25m), .D(inst471_q), .Q(inst479_q));  // open: PRN
  assign qbus_ad_h = ~qbus_ad;  // NOT inst15, 16 bits wide
  nand inst6 (inst6_out, inst18_q, qbus_a_h[12], qbus_a_h[10], qbus_a_h[8], qbus_a_h[6], qbus_a_h[4]);
  or inst8 (qbus_address_decoded_L, inst6_out, qbus_a_h[11], qbus_a_h[9], qbus_a_h[7], qbus_a_h[5], inst5_out);
  and inst23 (IN_H, qbus_din_in, inst20_out);
  and inst76 (OUT_LO_H, inst74_out, inst13_out, qbus_dout_in_delayed_H);
  and inst77 (OUT_HI_H, inst75_out, inst13_out, qbus_dout_in_delayed_H);
  nand inst410 (inst410_out, SELR_H, inst481_out);
  DFF inst377 (.CLK(GO_STROBE_2_L), .D(1'b0), .PRN(SET_CUR_L), .Q(CUR_DEL_H));  // open: CLRN
  nor inst440 (inst440_out, INIT_H, NPR_CLR_BBSY_H);
  not inst442 (CRCS_LRCS_H, CRCS_LRCS_L);
  or inst245 (DATA_BFR_IN_BIT_H[4], inst242_out, inst243_out, inst244_out, inst246_out);
  or inst250 (DATA_BFR_IN_BIT_H[5], inst247_out, inst248_out, inst249_out, inst251_out);
  or inst255 (DATA_BFR_IN_BIT_H[6], inst252_out, inst253_out, inst254_out, inst278_out);
  or inst259 (DATA_BFR_IN_BIT_H[7], inst256_out, inst257_out, inst258_out, inst261_out);
  nand inst263 (DATA_BFR_STB_2_H, inst262_out, inst285_out);
  DFF inst332 (.CLK(inst334_out), .D(1'b0), .PRN(INIT_GO_L), .Q(EOFF_L));  // open: CLRN
  not inst340 (OVERFLOW_L, OVERFLOW_H);
  not inst342 (CRE_L, debug[2]);
  not inst344 (RLE_L, debug[5]);
  not inst26 (NXM_L, debug[7]);
  not inst381 (CUR_DEL_L, CUR_DEL_H);
  DFF inst438 (.CLRN(inst440_out), .CLK(inst436_out), .D(EVEN_CHAR_STB_L), .Q(NPR_ENB_H));  // open: PRN
  not inst335 (EOFF_H, EOFF_L);
  assign inst457_out = mtcma[17:16] & {2{NPR_ADRS_BUS_H}};  // AND2 inst457, 2 bits wide
  DFF inst1[15:0] (.CLK(qbus_sync_in), .D(qbus_ad_h), .Q(qbus_a_h));  // open: CLRN, PRN
  DFF inst18 (.CLK(qbus_sync_in), .D(qbus_bs), .Q(inst18_q));  // open: CLRN, PRN
  \m304-1us  inst299 (
    .clk_25m(clk_25m), .in1(inst410_out), .in2(inst417_q), .out_h(GO_STROBE_2_H), .out_l(GO_STROBE_2_L));
  cnt_timer_10khz inst83 (.clock(clk_25m), .aclr(INIT_H), .aset(inst83_cout), .cout(inst83_cout), .q(div_10khz));
  not inst140 (WRITE_ENB_L, WRITE_ENB_H);
  nand inst149 (inst149_out, inst151_out_h, SPACE_REV_H);
  DFF inst485 (.CLRN(NPR_EN_H), .CLK(NPR_CLR_BBSY_H), .D(1'b1), .Q(inst485_q));  // open: PRN
  nand inst478 (inst478_out, qbus_iaki_L, inst479_q);
  TRI inst490[3:0] (.IN(4'b0000), .OE(4'b0000), .OUT(qbus_a[21:18]));
  TRI inst85[1:0] (.IN(2'b00), .OE(inst457_out), .OUT(qbus_a[17:16]));
  and inst44 (SEL_1_OUT_HI_H, SELECT_2H, OUT_HI_H);
  and inst43 (SEL_2_OUT_HI_H, SELECT_4H, OUT_HI_H);
  and inst25 (SEL_3_OUT_HI_H, SELECT_6H, OUT_HI_H);
  and inst17 (SEL_4_OUT_HI_H, SELECT_10H, OUT_HI_H);
  and inst45 (SEL_5_OUT_HI_H, SELECT_12H, OUT_HI_H);
  not inst174 (CRCS_H, tm11_crcs);
  not inst175 (LRCS_H, tm11_lrcs);
  not inst176 (WRS_H, tm11_wrs);
  not inst177 (EOT_H, tm11_eot);
  not inst178 (WRL_H, tm11_wrl);
  not inst183 (RDS_H, tm11_rds);
  not inst439 (NPR_ENB_L, NPR_ENB_H);
  DFF inst482 (.CLRN(NPR_EN_H), .CLK(clk_25m), .D(inst485_q), .Q(inst482_q));  // open: PRN
  and inst474 (INT_DONE_B_L, INIT_L, inst478_out);
  DFF inst417 (.CLK(inst469_out), .D(1'b0), .PRN(inst301_out), .Q(inst417_q));  // open: CLRN
  not inst138 (tm11_rev, SPACE_REV_L);
  nand inst139 (tm11_fwd, READ_L, SPACE_FWD_L, WRITE_ENB_L);
  nand inst142 (tm11_wre, WRITE_ENB_L, OFFLINE_L);
  nand inst143 (tm11_rwd, REWIND_L, OFFLINE_L);
  nand inst144 (tm11_wxg, WRITE_XIRG_L, WRITE_EOF_L);
  not inst145 (tm11_wfmk, WRITE_EOF_L);
  nand inst148 (tm11_cinit, inst149_out, INIT_L);
  DFF inst519 (.CLRN(NPR_EN_H), .CLK(clk_25m), .D(inst482_q), .Q(inst519_q));  // open: PRN
  not inst300 (INT_DONE_B_H, INT_DONE_B_L);
  and inst81 (SEL_1_OUT_LO_H, SELECT_2H, OUT_LO_H);
  and inst80 (SEL_2_OUT_LO_H, SELECT_4H, OUT_LO_H);
  and inst79 (SEL_3_OUT_LO_H, SELECT_6H, OUT_LO_H);
  and inst78 (SEL_4_OUT_LO_H, SELECT_10H, OUT_LO_H);
  nor inst473 (qbus_rply_out, OUT_LO_H, IN_H, OUT_HI_H, int_rply_out_H);
  DFF inst82 (.CLRN(INIT_L), .CLK(div_10khz[10]), .D(inst56_out), .Q(TIMER_H));  // open: PRN
  not inst56 (inst56_out, TIMER_H);
  nand inst186 (inst186_out, qbus_dmgi_L, inst519_q);
  bus_led_pulse_stretcher inst28 (.clk_25m(clk_25m), .bus_led_rply_in(qbus_rply_out), .led_bus(led_bus));
  assign mts[15] = debug[1];  // WIRE inst55
  assign mts[14] = EOFF_H;  // WIRE inst57
  assign mts[13] = debug[2];  // WIRE inst58
  assign mts[12] = debug[3];  // WIRE inst59
  assign mts[11] = debug[4];  // WIRE inst60
  assign mts[10] = EOT_H;  // WIRE inst61
  assign mts[9] = debug[5];  // WIRE inst62
  assign mts[8] = debug[6];  // WIRE inst63
  assign mts[7] = debug[7];  // WIRE inst64
  assign mts[6] = SELR_H;  // WIRE inst65
  assign mts[5] = BOT_H;  // WIRE inst66
  assign mts[4] = \7CH_H ;  // WIRE inst67
  assign mts[3] = SDWN_H;  // WIRE inst68
  assign mts[2] = WRL_H;  // WIRE inst69
  assign mts[1] = RWS_H;  // WIRE inst70
  assign mts[0] = TUR_H;  // WIRE inst71
  and inst518 (NPR_RESET_L, inst186_out, INIT_L);
  not inst84 (inst84_out, CLK_2_H);
  not inst49 (inst49_out, inst46_cout);
  not inst54 (inst54_out, inst51_cout);
  not inst52 (inst52_out, inst50_cout);
  count_26 inst48 (.clock(clk_25m), .q(\1hz_div ));
  count_8_aload inst46 (
    .data(qbus_ad_h[7:0]), .clock(inst84_out), .aclr(INIT_H), .aload(SEL_2_OUT_LO_H), .cout(inst46_cout),
    .q(mtbrc[7:0]));
  count_8_aload inst47 (
    .data(qbus_ad_h[15:8]), .clock(inst49_out), .aclr(INIT_H), .aload(SEL_2_OUT_HI_H), .cout(inst47_cout),
    .q(mtbrc[15:8]));
  count_2_aload inst53 (
    .data(qbus_ad_h[5:4]), .clock(inst54_out), .aclr(INIT_H), .aload(SEL_1_OUT_LO_H), .q(mtcma[17:16]));
  count_8_aload inst51 (
    .data(qbus_ad_h[15:8]), .clock(inst52_out), .aclr(INIT_H), .aload(SEL_3_OUT_HI_H), .cout(inst51_cout),
    .q(mtcma[15:8]));
  count_8_aload inst50 (
    .data(qbus_ad_h[7:0]), .clock(NPR_CLR_BBSY_H), .aclr(INIT_H), .aload(SEL_3_OUT_LO_H), .cout(inst50_cout),
    .q(mtcma[7:0]));
  assign mtc[15] = debug[0];  // WIRE inst86
  assign mtc[14] = tm11_den8;  // WIRE inst87
  assign mtc[13] = DEN5_H;  // WIRE inst88
  assign mtc[12] = 1'b0;  // WIRE inst89
  assign mtc[11] = tm11_pevn;  // WIRE inst90
  assign mtc[10] = UNIT_SEL_BIT_TM_H[2];  // WIRE inst91
  assign mtc[9] = UNIT_SEL_BIT_TM_H[1];  // WIRE inst92
  assign mtc[8] = UNIT_SEL_BIT_TM_H[0];  // WIRE inst93
  assign mtc[7] = CU_READY_H;  // WIRE inst94
  assign mtc[6] = INT_ENB_H;  // WIRE inst95
  assign mtc[5] = mtcma[17];  // WIRE inst96
  assign mtc[4] = mtcma[16];  // WIRE inst97
  assign mtc[3] = FUNCTION_BIT_H[2];  // WIRE inst98
  assign mtc[2] = FUNCTION_BIT_H[1];  // WIRE inst99
  assign mtc[1] = FUNCTION_BIT_H[0];  // WIRE inst100
  assign mtc[0] = GO_BIT_H;  // WIRE inst101
  not inst357 (CARRY_OUT_2_L, inst47_cout);
  assign mtd[15:9] = DATA_BFR_OUT_BIT_H[7:1];  // WIRE inst72
  assign mtd[8] = D_BIT_08_IN_H;  // WIRE inst200
  assign mtd[7:0] = DATA_BFR_OUT_BIT_H;  // WIRE inst201
  assign mtrd[15] = TIMER_H;  // WIRE inst73
  assign mtrd[14] = LRC_ENB_H;  // WIRE inst195
  assign mtrd[13] = 1'b0;  // WIRE inst196
  assign mtrd[12] = GSD_H;  // WIRE inst197
  assign mtrd[11] = 1'b0;  // WIRE inst198
  assign mtrd[10] = 1'b0;  // WIRE inst199
  assign mtrd[9] = 1'b0;  // WIRE inst202
  assign mtrd[8] = CHAN_P_H;  // WIRE inst203
  assign mtrd[7:0] = CHAN_H;  // WIRE inst204

  assign debug[15:8] = debug_tu10;
  assign qbus_virq5 = qbus_virq4;
  assign qbus_virq6 = 1'b1;
  assign qbus_virq7 = 1'b1;
  assign tm11_debug = {debug[0], debug[2], debug[3]};

  // Other names for the same wires on the sheet: 7CH = tm11_7ch; BGL_H = debug[4]; BOT = tm11_bot; BTE_H = debug[6];
  //   CINIT = tm11_cinit; CRCS = tm11_crcs; CRE_H = debug[2]; DEN5 = tm11_den5; DEN8_H = tm11_den8; EOT = tm11_eot;
  //   ERR_H = debug[0]; FMK = tm11_fmk; FWD = tm11_fwd; ILC_H = debug[1]; INIT_REC_H = qbus_init; LRCE_L = tm11_lrce;
  //   LRCS = tm11_lrcs; NPR_DIN_L = qbus_din_out; NPR_SYNC_OUT_L = qbus_sync_out; NXM_H = debug[7]; PAE_H = debug[3];
  //   PEVN_H = tm11_pevn; qbus_dmgi_H = qbus_dmgi; qbus_iaki_H = qbus_iaki; qbus_iako_L = qbus_iako;
  //   qbus_rply_in_H = qbus_rply_in; qbus_sync_in_H = qbus_sync_in; qbus_wtbt_in_H = qbus_wtbt_in; RD[7:0] = tm11_rd;
  //   RDP = tm11_rdp; RDS = tm11_rds; REV = tm11_rev; RLE_H = debug[5]; RWD = tm11_rwd; RWS = tm11_rws;
  //   SDWN = tm11_sdwn; SELR = tm11_selr; SET_H = tm11_set; CRCE_L = tm11_crce; TUR = tm11_tur; VPE_L = tm11_vpe;
  //   WD[7:0] = {tm11_wd[7], tm11_wd[6], tm11_wd[5], tm11_wd[4], tm11_wd[3], tm11_wd[2], tm11_wd[1], tm11_wd[0]};
  //   WDR_H = tm11_wdr; WFMK = tm11_wfmk; WRE = tm11_wre; WRL = tm11_wrl; WRS = tm11_wrs; WXG = tm11_wxg

  // Notes on the sheet:
  //   MTS
  //   MTC
  //   MTD
  //   MTRD
  //   INT vector - 224 oct
  //   Register read mux
  //   0 - normal QBUS operation
  //   1 - DMA address
  //   2 - DMA data
  //   3 - IRQ vector
  //   Calculate proper delay
  //   Add delay also to DIN?
  //   Test LOAD functionality
  //   Replace with counter if needed
  //   TM11-0-06
  //   Changed signal - SLCT_1_OUT_LO_L
  //   Should be properly tested, mess in schematics
  //   TUR should be delayed a bit after RWS
  //   Very meesed up schematic symbol
  //   TM11-0-07
  //   This can be replaced with XOR
  //   Was inverted input and swapped outputs in sch
  //   TM11-0-08
  //   TM11-0-09
  //   TM11-0-10
  //   Add virtual input pins from emulated TU10
  //   TM11-0-11
  //   TM11-0-12
  //   TM11-0-13
  //   Should be tested, original signal is SLCT_1_OUT_LO_H
  //   TM11-0-17
  //   TM11-0-18
  //   Additional delay so the data buffer output would settle down
  //   Correct signal - SLCT_4_OUT_LO_L, should be tested
  //   Correct signal - SLCT_4_OUT_LO_L, should be tested
  //   TM11-0-19
  //   MAINTENANCE PANEL
  //   TM11-0-20
  //   TM11-0-21
  //   TM11-0-22
  //   DMA
  //   Temp flip-flop
  //   Delay between asserting an address and SYNC
  //   Replace this temporary delay with proper 300ns delay
  //   Delay between SYNC and data exchange
  //   Replace this temporary delay with proper 200ns delay
  //   Delay between data output and DOUT signal
  //   Replace this temporary delay with proper 100ns delay
  //   Delay between RPLY receive and DOUT negating
  //   Replace this temporary delay with proper 200ns delay
  //   Delay between DOUT negating and end of the DMA out cycle
  //   Replace this temporary delay with proper 200ns delay
  //   Maybe DMA reset pulse should be stretched a bit?
  //   Bus timeout timer, waits for RPLY signal fron the addressed device
  //   Replace this temporary delay with proper 10us delay
  //   RPLY stops timer
  //   IRQ
  //   IRQ6 and 7 should be inputs that disable this lower level interrupt!
  //   This asserts INT request signal
  //   This enables data out
  //   This waits until different INT is finished
  //   These delays a reset signal a bit
  //   This waits for IAKI to go low and resets this state machine
endmodule
